# Altium schematic sheet Transeiver.SchDoc
size A4
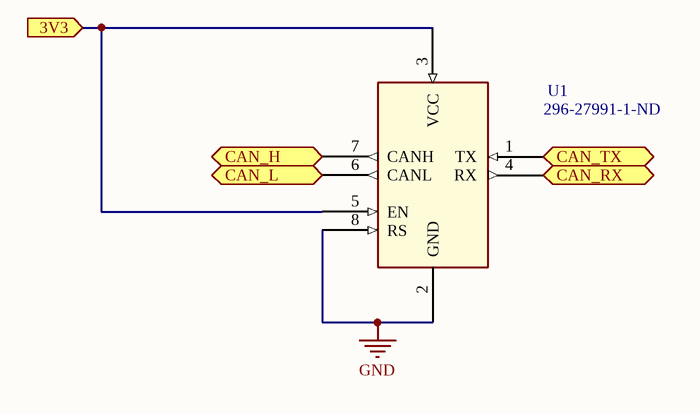
[diagram p0: Transeiver.SchDoc]

## Parts
U1  Supplier Part Number 1: 296-27991-1-ND  [SN65HVD234DR]  (hidden comment: SN65HVD234)

## Ports
3V3 (in), CAN_H (bidir), CAN_L (bidir), CAN_RX (out), CAN_TX (in)

## Nets
GND: U1.2(GND) U1.8(RS)
3V3: U1.3(VCC) U1.5(EN) ; port 3V3
CAN_H: U1.7(CANH) ; port CAN_H
CAN_L: U1.6(CANL) ; port CAN_L
CAN_RX: U1.4(RX) ; port CAN_RX
CAN_TX: U1.1(TX) ; port CAN_TX

## Library data of the parts
U1 = SN65HVD234: IC CAN TRANSCEIVER 3.3V 8-SOIC; Number of Drivers/Receivers: 1/1; Duplex: Half; Receiver Hysteresis: 100mV; Data Rate: 1Mbps; Voltage - Supply: 3 V ~ 3.6 V; Supplier 1: Digi-Key; Manufacturer Part Number: SN65HVD234DR; Type: Transceiver; Protocol: CAN; Operating Temperature: -40°C ~ 125°C; Package / Case: 8-SOIC